# EAGLE design MyDaq Breadboard (EAGLE 6.4)
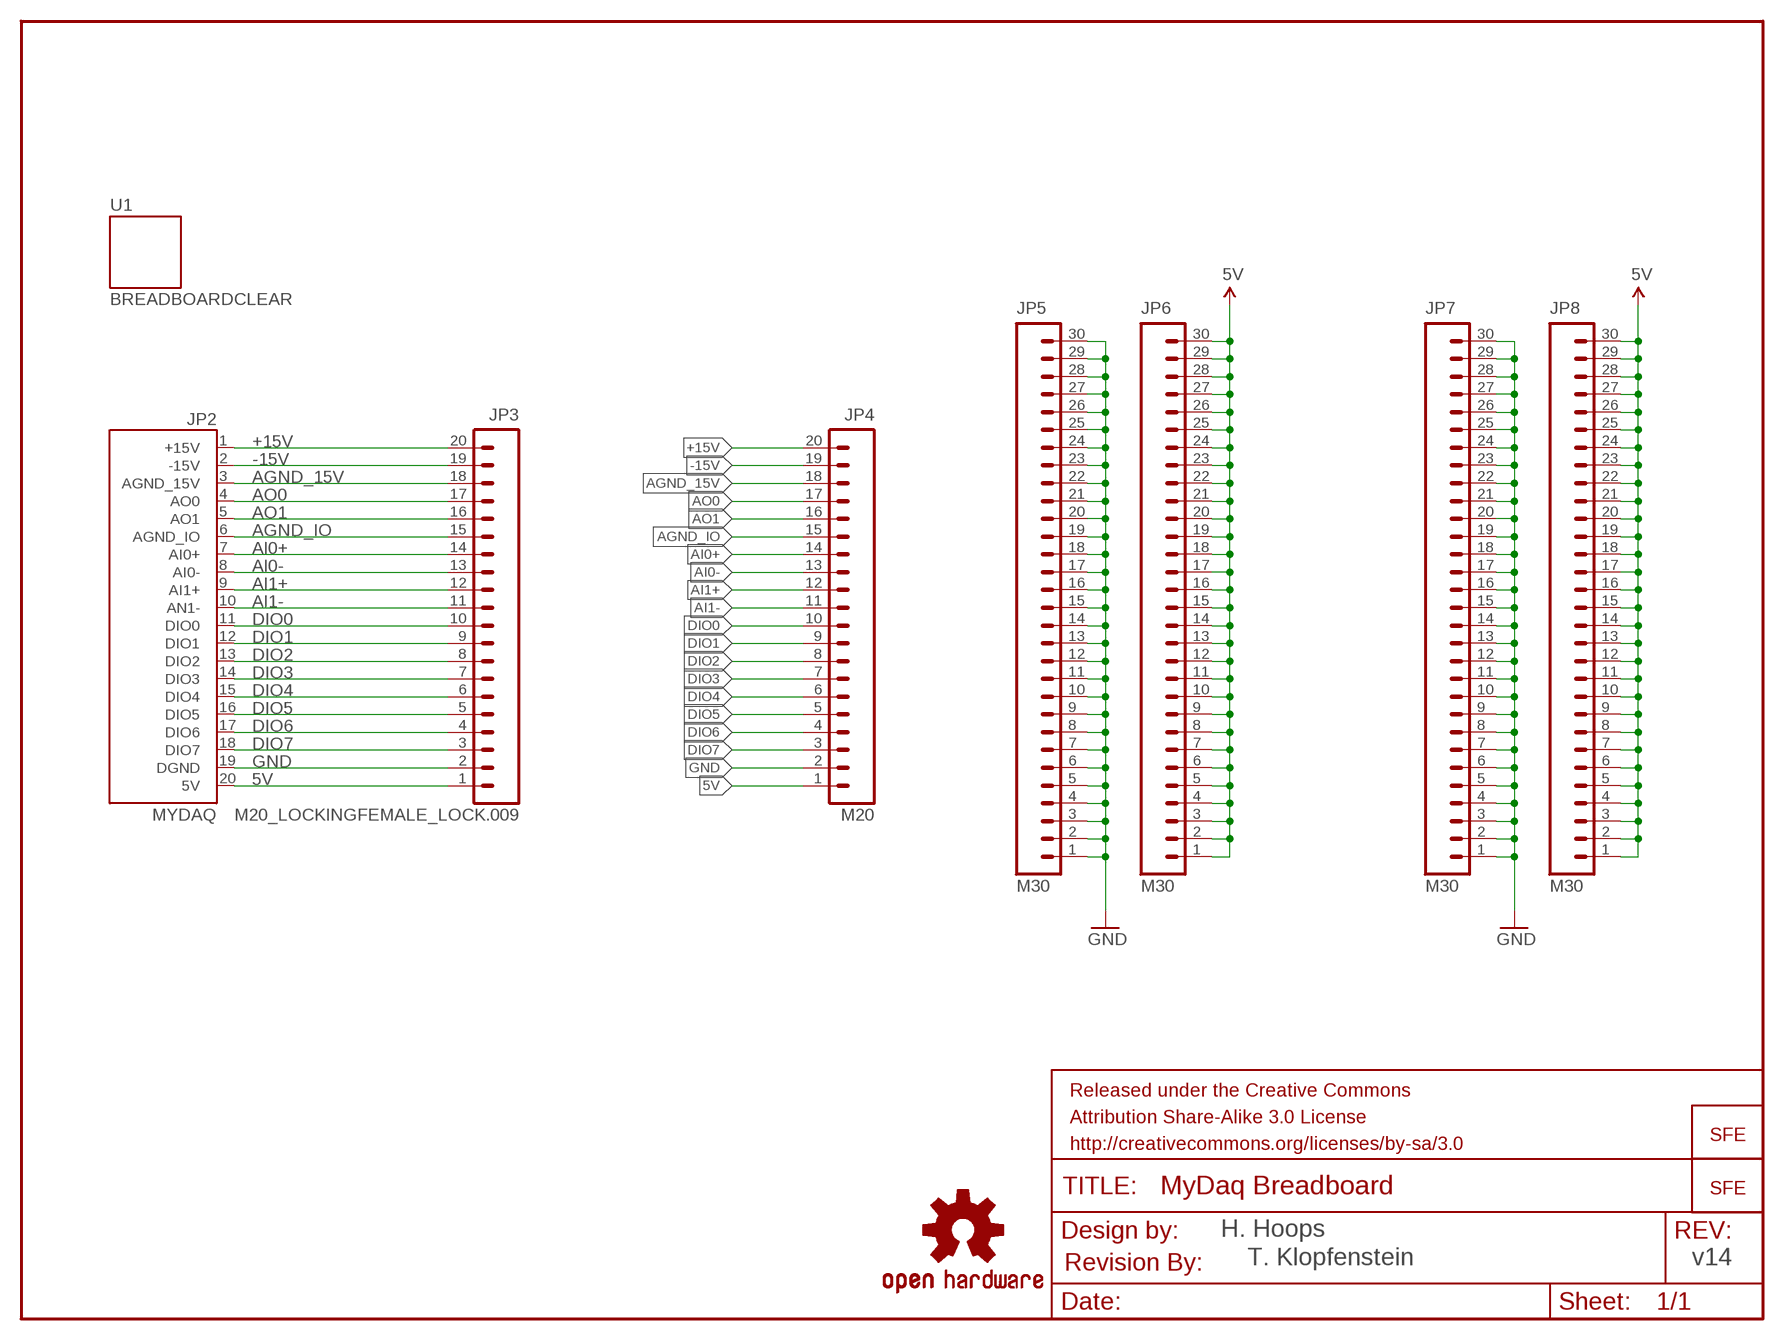
[diagram p0: schematic, sheet 1]

## Parts
FRAME2  FRAME-LETTER  [CREATIVE_COMMONS]
JP1  LOGO-SFENEW  [SFE-NEW-WEBLOGO]
JP2  MYDAQ  [3.81MM_TERMINAL_BLOCK_FEMALE_LOCKING]
JP3  M20_LOCKINGFEMALE_LOCK.009  M20_LOCKINGLOCK  [1X20_LOCK]
JP4  M20  [1X20]
JP5  M30  [1X30]
JP6  M30  [1X30]
JP7  M30  [1X30]
JP8  M30  [1X30]
LOGO1  OSHW-LOGOL  [OSHW-LOGO-L]
LOGO2  LOGO-SFESK  [SFE-LOGO-FLAME]
U1  BREADBOARDCLEAR  [BREADBOARD_CLEAR]
U$3  REVISION  [REVISION]

## Nets
5V: JP2.20(5V) JP3.1 JP4.1 JP6.1 JP6.2 JP6.3 JP6.4 JP6.5 JP6.6 JP6.7 JP6.8 JP6.9 JP6.10 JP6.11 JP6.12 JP6.13 JP6.14 JP6.15 JP6.16 JP6.17 JP6.18 JP6.19 JP6.20 JP6.21 JP6.22 JP6.23 JP6.24 JP6.25 JP6.26 JP6.27 JP6.28 JP6.29 JP6.30 JP8.1 JP8.2 JP8.3 JP8.4 JP8.5 JP8.6 JP8.7 JP8.8 JP8.9 JP8.10 JP8.11 JP8.12 JP8.13 JP8.14 JP8.15 JP8.16 JP8.17 JP8.18 JP8.19 JP8.20 JP8.21 JP8.22 JP8.23 JP8.24 JP8.25 JP8.26 JP8.27 JP8.28 JP8.29 JP8.30
+15V: JP2.1(+15V) JP3.20 JP4.20
-15V: JP2.2(-15V) JP3.19 JP4.19
AGND_15V: JP2.3(AGND_15V) JP3.18 JP4.18
AGND_IO: JP2.6(AGND_IO) JP3.15 JP4.15
AI0+: JP2.7(AI0+) JP3.14 JP4.14
AI0-: JP2.8(AI0-) JP3.13 JP4.13
AI1+: JP2.9(AI1+) JP3.12 JP4.12
AI1-: JP2.10(AN1-) JP3.11 JP4.11
AO0: JP2.4(AO0) JP3.17 JP4.17
AO1: JP2.5(AO1) JP3.16 JP4.16
DIO0: JP2.11(DIO0) JP3.10 JP4.10
DIO1: JP2.12(DIO1) JP3.9 JP4.9
DIO2: JP2.13(DIO2) JP3.8 JP4.8
DIO3: JP2.14(DIO3) JP3.7 JP4.7
DIO4: JP2.15(DIO4) JP3.6 JP4.6
DIO5: JP2.16(DIO5) JP3.5 JP4.5
DIO6: JP2.17(DIO6) JP3.4 JP4.4
DIO7: JP2.18(DIO7) JP3.3 JP4.3
GND: JP2.19(DGND) JP3.2 JP4.2 JP5.1 JP5.2 JP5.3 JP5.4 JP5.5 JP5.6 JP5.7 JP5.8 JP5.9 JP5.10 JP5.11 JP5.12 JP5.13 JP5.14 JP5.15 JP5.16 JP5.17 JP5.18 JP5.19 JP5.20 JP5.21 JP5.22 JP5.23 JP5.24 JP5.25 JP5.26 JP5.27 JP5.28 JP5.29 JP5.30 JP7.1 JP7.2 JP7.3 JP7.4 JP7.5 JP7.6 JP7.7 JP7.8 JP7.9 JP7.10 JP7.11 JP7.12 JP7.13 JP7.14 JP7.15 JP7.16 JP7.17 JP7.18 JP7.19 JP7.20 JP7.21 JP7.22 JP7.23 JP7.24 JP7.25 JP7.26 JP7.27 JP7.28 JP7.29 JP7.30

## Notes on the sheet
- H. Hoops
- T. Klopfenstein | v14

## Library data of the parts
FRAME2 = SparkFun-Aesthetics:FRAME-LETTER: Schematic Frame Standard 8.5x11 US Letter frame
JP1 = SparkFun:LOGO-SFE: Spark Fun Electronics PCB Logo This is the standard Spark Fun Electronics PCB logo.
JP2 = Local Lirary:MYDAQ
JP3 = Local Library:M20_LOCKING: This is just like the LOCK variant in that the holes are staggared by 5 mil, but except for the last two holes. They are not altered from the "standard" footprint layout. This is used for a special purpose on the layout of our Graphic LCD Backpack. Make sure you want to use this device before selecting it for you project!
JP4 = Local Lirary:M20: This is just like the LOCK variant in that the holes are staggared by 5 mil, but except for the last two holes. They are not altered from the "standard" footprint layout. This is used for a special purpose on the layout of our Graphic LCD Backpack. Make sure you want to use this device before selecting it for you project!
JP5-JP8 = Local Library:M30
LOGO1 = SparkFun-Aesthetics:OSHW-LOGO: Open Source Hardware Logo This logo indicates the piece of hardware it is found on incorporates a OSHW license and/or adheres to the definition of open source hardware found here: http://freedomdefined.org/OSHW
LOGO2 = SparkFun-Aesthetics:LOGO-SFE: Spark Fun Electronics PCB Logo This is the standard Spark Fun Electronics PCB logo.
U1 = Local Lirary:BREADBOARD: Breadboard Mini Self Adhesive This is the mechnical outline for the very small self adhesive breadboard from SparkFun Electronics. Good for very small proto areas. SKU : PRT-07916
U$3 = SparkFun-Aesthetics:REVISION

## Board
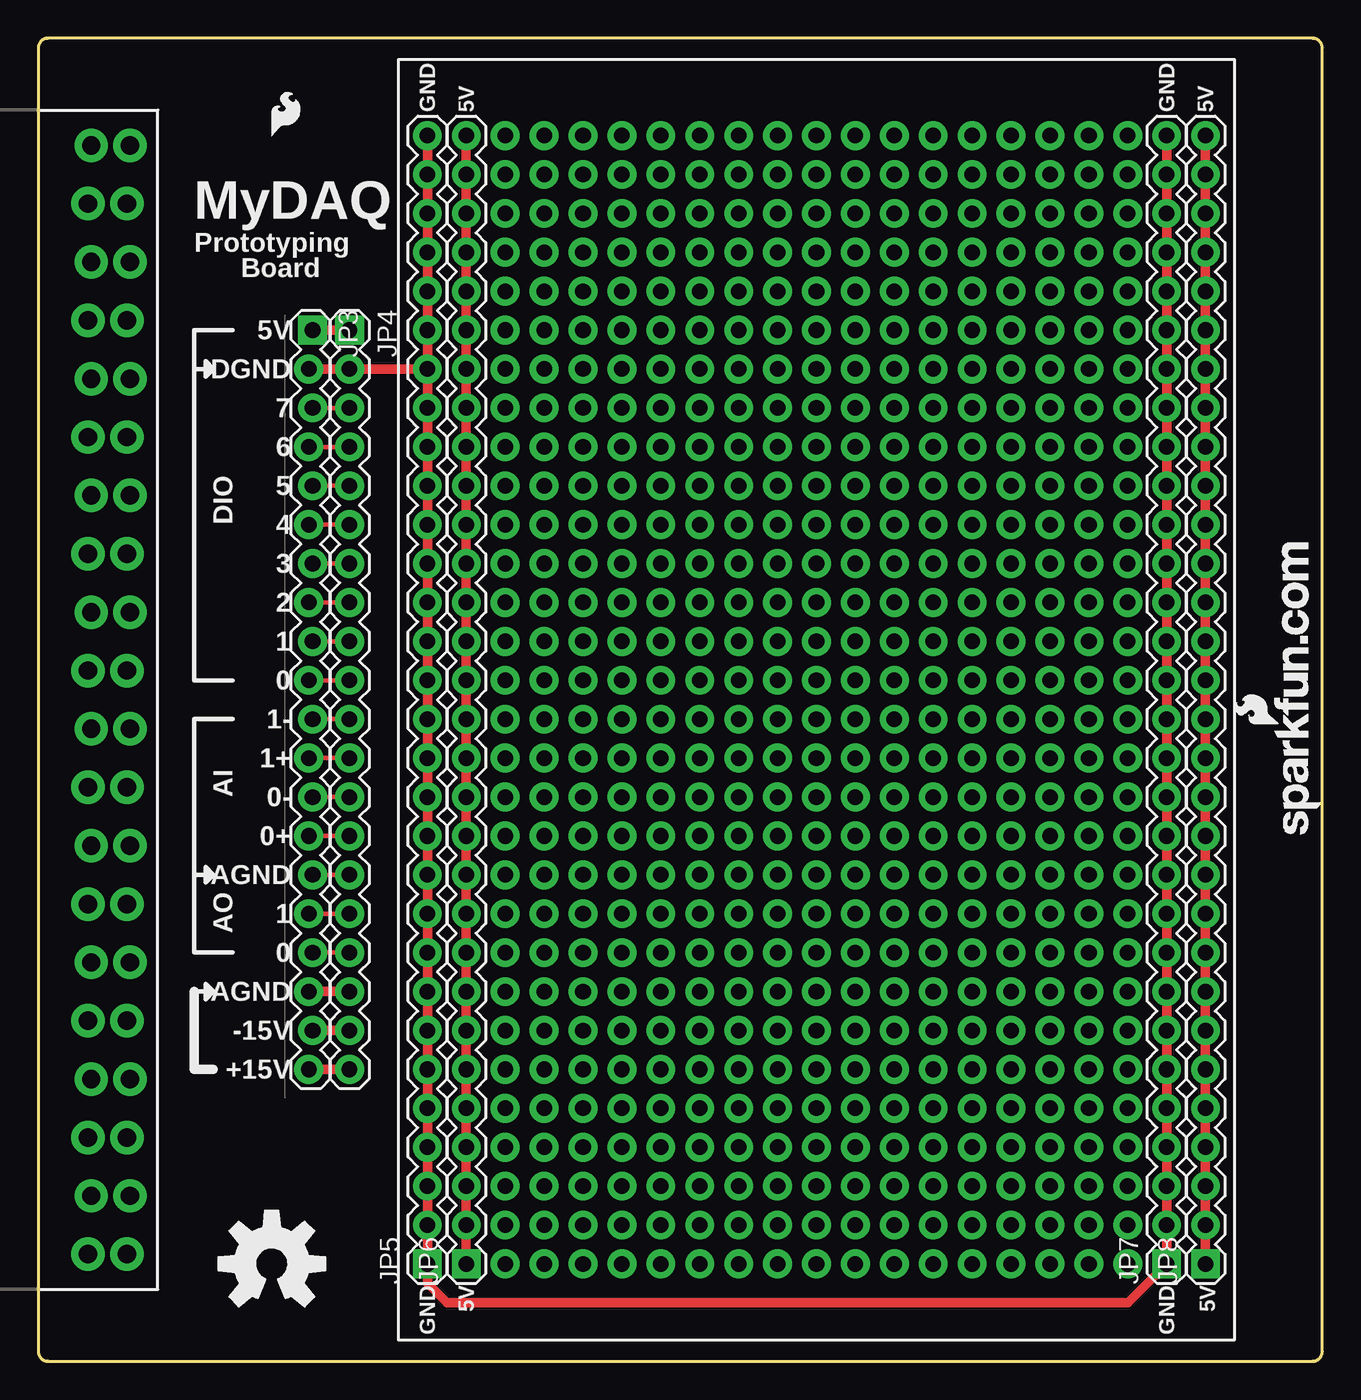
[diagram p1: board, top side]
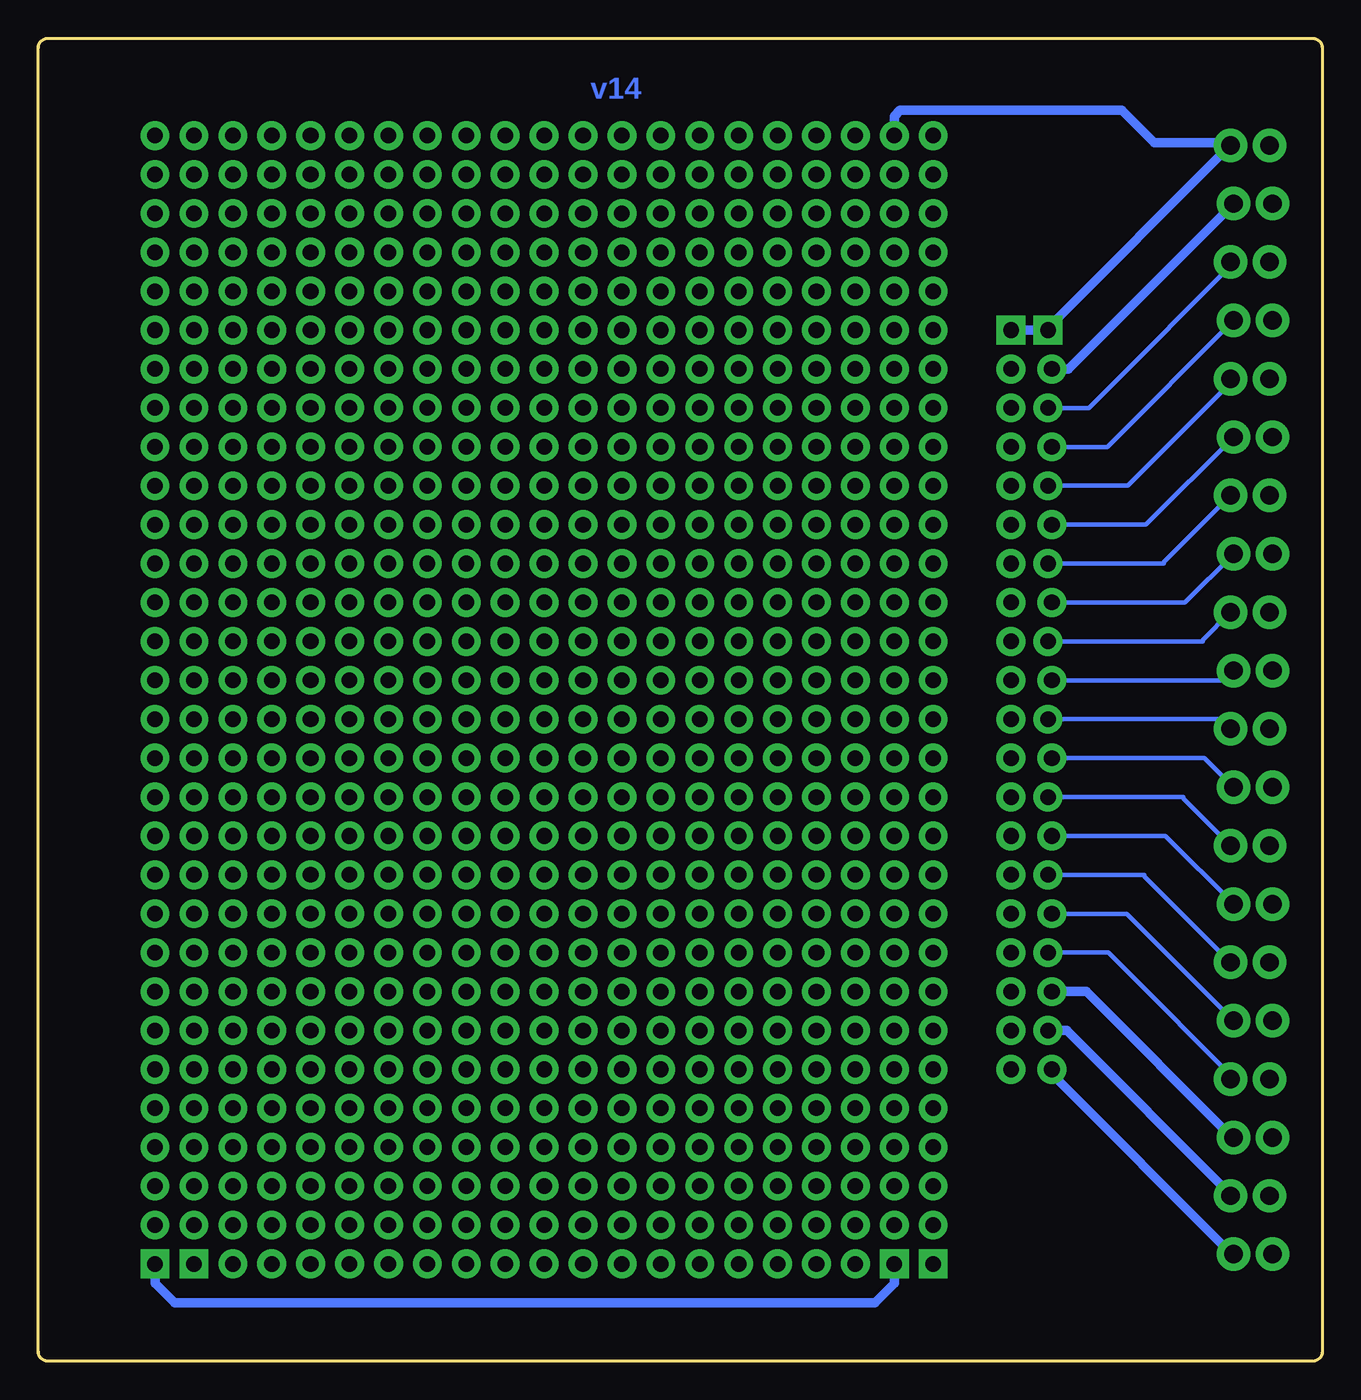
[diagram p2: board, bottom side, seen from below]

Size 83.82 x 86.36 mm. Coordinates in mm from the lower left corner, seen from the top.
Outline: 83.19,0 arc90 83.82,0.64 83.82,85.72 arc90 83.19,86.36 0.64,86.36 arc90 0,85.72 0,0.64 arc90 0.64,0 83.19,0
Copper layers (1*16): Top 0.035mm / dielectric 1.5mm / Bottom 0.035mm
Design rules "SparkFun": minimum track width 8mil, minimum drill 20mil, track to track 8mil, track to pad 8mil, pad to pad 8mil, via to via 8mil, smd to smd 8mil, copper to edge 8mil, drill to drill 8mil, minimum pad ring 12mil, minimum via ring 10mil, stop-mask expansion 4mil, vias tented up to drill 20mil, thermal gap 10mil

### Footprints (pad centres in the part's own frame; a part is rotated, then mirrored left to right if it is on the bottom)
3.81MM_TERMINAL_BLOCK_FEMALE_LOCKING = drill 1.2 pad 2.184: 1 4.521,-36.194; 2 4.724,-32.384; 3 4.521,-28.574; 4 4.724,-24.764; 5 4.521,-20.954; 6 4.724,-17.144; 7 4.521,-13.334; 8 4.724,-9.524; 9 4.521,-5.714; 10 4.724,-1.904; 11 4.521,1.906; 12 4.724,5.716; 13 4.521,9.526; 14 4.724,13.336; 15 4.521,17.146; 16 4.724,20.956; 17 4.521,24.766; 18 4.724,28.576; 19 4.521,32.386; 20 4.724,36.196; @1 1.981,-36.194; @2 2.184,-32.384; @3 1.981,-28.574; @4 2.184,-24.764; @5 1.981,-20.954; @6 2.184,-17.144; @7 1.981,-13.334; @8 2.184,-9.524; @9 1.981,-5.714; @10 2.184,-1.904; @11 1.981,1.906; @12 2.184,5.716; @13 1.981,9.526; @14 2.184,13.336; @15 1.981,17.146; @16 2.184,20.956; @17 1.981,24.766; @18 2.184,28.576; @19 1.981,32.386; @20 2.184,36.196
1X20_LOCK = drill 1.016 pad 1.88 square: 1 0,0.127 | drill 1.016 pad 1.88: 2 2.54,-0.127; 3 5.08,0.127; 4 7.62,-0.127; 5 10.16,0.127; 6 12.7,-0.127; 7 15.24,0.127; 8 17.78,-0.127; 9 20.32,0.127; 10 22.86,-0.127; 11 25.4,0.127; 12 27.94,-0.127; 13 30.48,0.127; 14 33.02,-0.127; 15 35.56,0.127; 16 38.1,-0.127; 17 40.64,0.127; 18 43.18,-0.127; 19 45.72,0.127; 20 48.26,-0.127
1X20 = drill 1.016 pad 1.88 square: 1 0,0 | drill 1.016 pad 1.88: 2 2.54,0; 3 5.08,0; 4 7.62,0; 5 10.16,0; 6 12.7,0; 7 15.24,0; 8 17.78,0; 9 20.32,0; 10 22.86,0; 11 25.4,0; 12 27.94,0; 13 30.48,0; 14 33.02,0; 15 35.56,0; 16 38.1,0; 17 40.64,0; 18 43.18,0; 19 45.72,0; 20 48.26,0
1X30 = drill 1.016 pad 1.88 square: 1 0,0 | drill 1.016 pad 1.88: 2 2.54,0; 3 5.08,0; 4 7.62,0; 5 10.16,0; 6 12.7,0; 7 15.24,0; 8 17.78,0; 9 20.32,0; 10 22.86,0; 11 25.4,0; 12 27.94,0; 13 30.48,0; 14 33.02,0; 15 35.56,0; 16 38.1,0; 17 40.64,0; 18 43.18,0; 19 45.72,0; 20 48.26,0; 21 50.8,0; 22 53.34,0; 23 55.88,0; 24 58.42,0; 25 60.96,0; 26 63.5,0; 27 66.04,0; 28 68.58,0; 29 71.12,0; 30 73.66,0

### Placement (x,y rotation side)
FRAME2  -7.09,-7.62 0 top  (outside the outline)
JP1  83.82,34.42 90 top
JP2  1.27,43.18 0 top
JP3  17.78,67.31 270 top
JP4  20.32,67.31 270 top
JP5  25.4,6.35 90 top
JP6  27.94,6.35 90 top
JP7  73.66,6.35 90 top
JP8  76.2,6.35 90 top
LOGO1  15.24,6.35 0 top
LOGO2  15.24,80.01 0 top
U1  50.8,43.18 90 top
U$3  4.45,-10.54 0 top  (outside the outline)

### Tracks (layer width: path | path; a pad name or v marks a point on that pad's centre or on a via)
5V
  Top 0.61: JP6.30 JP6.29 JP6.28 JP6.27 JP6.26 JP6.25 JP6.24 JP6.23 JP6.22 JP6.21 JP6.20 JP6.19 JP6.18 JP6.17 JP6.16 JP6.15 JP6.14 JP6.13 JP6.12 JP6.11 JP6.10 JP6.9 JP6.8 JP6.7 JP6.6 JP6.5 JP6.4 JP6.3 JP6.2 JP6.1 | JP8.1 JP8.2 JP8.3 JP8.4 JP8.5 JP8.6 JP8.7 JP8.8 JP8.9 JP8.10 JP8.11 JP8.12 JP8.13 JP8.14 JP8.15 JP8.16 JP8.17 JP8.18 JP8.19 JP8.20 JP8.21 JP8.22 JP8.23 JP8.24 JP8.25 JP8.26 JP8.27 JP8.28 JP8.29 JP8.30 | JP4.1 JP3.1
  Bottom 0.305: JP3.1 17.91,67.36
  Bottom 0.61: JP6.30 27.94,81.28 27.56,81.66 13.08,81.66 10.97,79.55 6.17,79.55 JP2.20 18.06,67.31 JP4.1 | JP8.30 76.07,80.01 | JP6.1 27.94,5.08 29.21,3.81 74.93,3.81 76.2,5.08 JP8.1
+15V
  Top 0.61: JP3.20 JP4.20
  Bottom 0.61: JP3.20 17.65,18.75 5.89,6.99 JP2.1
-15V
  Top 0.61: JP3.19 JP4.19
  Bottom 0.61: JP3.19 16.69,21.59 5.99,10.9 JP2.2
AGND_15V
  Top 0.61: JP3.18 JP4.18
  Bottom 0.61: JP3.18 15.42,24.13 5.89,14.61 JP2.3
AGND_IO
  Top 0.305: JP3.15 JP4.15
  Bottom 0.305: JP3.15 11.61,31.75 11.61,31.65 JP2.6
AI0+
  Top 0.305: JP3.14 JP4.14
  Bottom 0.305: JP3.14 10.34,34.29 10.23,34.29 JP2.7
AI0-
  Top 0.305: JP3.13 JP4.13
  Bottom 0.305: JP3.13 9.07,36.83 9.07,36.73 JP2.8
AI1+
  Top 0.305: JP3.12 JP4.12
  Bottom 0.305: JP3.12 7.8,39.37 7.7,39.37 JP2.9
AI1-
  Top 0.305: JP3.11 JP4.11
  Bottom 0.305: JP3.11 6.53,41.91 6.53,41.81 JP2.10
AO0
  Top 0.305: JP3.17 JP4.17
  Bottom 0.305: JP3.17 14.15,26.67 13.97,26.67 12.7,25.4 5.99,18.69 JP2.4
AO1
  Top 0.305: JP3.16 JP4.16
  Bottom 0.305: JP3.16 12.88,29.21 12.78,29.21 JP2.5
DIO0
  Top 0.305: JP3.10 JP4.10
  Bottom 0.305: JP3.10 6.53,44.45 6.43,44.45 JP2.11
DIO1
  Top 0.305: JP3.9 JP4.9
  Bottom 0.305: JP3.9 7.8,46.99 7.8,47.09 JP2.12
DIO2
  Top 0.305: JP3.8 JP4.8
  Bottom 0.305: JP3.8 9.07,49.53 8.97,49.53 JP2.13
DIO3
  Top 0.305: JP3.7 JP4.7
  Bottom 0.305: JP3.7 10.34,52.07 10.34,52.17 JP2.14
DIO4
  Top 0.305: JP3.6 JP4.6
  Bottom 0.305: JP3.6 11.61,54.61 11.51,54.61 JP2.15
DIO5
  Top 0.305: JP3.5 JP4.5
  Bottom 0.305: JP3.5 12.88,57.15 12.7,57.15 11.43,58.42 5.99,63.86 JP2.16
DIO6
  Top 0.305: JP3.4 JP4.4
  Bottom 0.305: JP3.4 14.15,59.69 14.05,59.69 JP2.17
DIO7
  Top 0.305: JP3.3 JP4.3
  Bottom 0.305: JP3.3 15.42,62.23 15.24,62.23 13.97,63.5 5.99,71.48 JP2.18
GND
  Top 0.61: JP7.30 JP7.29 JP7.28 JP7.27 JP7.26 JP7.25 JP7.24 JP7.23 JP7.22 JP7.21 JP7.20 JP7.19 JP7.18 JP7.17 JP7.16 JP7.15 JP7.14 JP7.13 JP7.12 JP7.11 JP7.10 JP7.9 JP7.8 JP7.7 JP7.6 JP7.5 JP7.4 JP7.3 JP7.2 JP7.1 71.12,3.81 26.67,3.81 25.4,5.08 JP5.1 JP5.2 JP5.3 JP5.4 JP5.5 JP5.6 JP5.7 JP5.8 JP5.9 JP5.10 JP5.11 JP5.12 JP5.13 JP5.14 JP5.15 JP5.16 JP5.17 JP5.18 JP5.19 JP5.20 JP5.21 JP5.22 JP5.23 JP5.24 | JP5.24 JP5.25 JP5.26 JP5.27 JP5.28 JP5.29 JP5.30 | JP3.2 JP4.2 JP5.24
  Bottom 0.61: JP3.2 16.69,64.77 16.59,64.77 JP2.19
N$1  (via drill 1.02 pad 1.88)
  other vias: 66.04,77.47
N$2  (via drill 1.02 pad 1.88)
  other vias: 63.5,77.47
N$3  (via drill 1.02 pad 1.88)
  other vias: 60.96,77.47
N$4  (via drill 1.02 pad 1.88)
  other vias: 30.48,80.01
N$5  (via drill 1.02 pad 1.88)
  other vias: 33.02,80.01
N$6  (via drill 1.02 pad 1.88)
  other vias: 35.56,80.01
N$7  (via drill 1.02 pad 1.88)
  other vias: 38.1,80.01
N$8  (via drill 1.02 pad 1.88)
  other vias: 40.64,80.01
N$9  (via drill 1.02 pad 1.88)
  other vias: 43.18,80.01
N$10  (via drill 1.02 pad 1.88)
  other vias: 45.72,80.01
N$11  (via drill 1.02 pad 1.88)
  other vias: 48.26,80.01
N$12  (via drill 1.02 pad 1.88)
  other vias: 50.8,80.01
N$13  (via drill 1.02 pad 1.88)
  other vias: 53.34,80.01
N$14  (via drill 1.02 pad 1.88)
  other vias: 55.88,80.01
N$15  (via drill 1.02 pad 1.88)
  other vias: 58.42,80.01
N$16  (via drill 1.02 pad 1.88)
  other vias: 66.04,80.01
N$17  (via drill 1.02 pad 1.88)
  other vias: 63.5,80.01
N$18  (via drill 1.02 pad 1.88)
  other vias: 60.96,80.01
N$19  (via drill 1.02 pad 1.88)
  other vias: 30.48,77.47
N$20  (via drill 1.02 pad 1.88)
  other vias: 33.02,77.47
N$21  (via drill 1.02 pad 1.88)
  other vias: 35.56,77.47
N$22  (via drill 1.02 pad 1.88)
  other vias: 38.1,77.47
N$23  (via drill 1.02 pad 1.88)
  other vias: 40.64,77.47
N$24  (via drill 1.02 pad 1.88)
  other vias: 43.18,77.47
N$25  (via drill 1.02 pad 1.88)
  other vias: 45.72,77.47
N$26  (via drill 1.02 pad 1.88)
  other vias: 48.26,77.47
N$27  (via drill 1.02 pad 1.88)
  other vias: 50.8,77.47
N$28  (via drill 1.02 pad 1.88)
  other vias: 53.34,77.47
N$29  (via drill 1.02 pad 1.88)
  other vias: 55.88,77.47
N$30  (via drill 1.02 pad 1.88)
  other vias: 58.42,77.47
N$31  (via drill 1.02 pad 1.88)
  other vias: 68.58,80.01
N$32  (via drill 1.02 pad 1.88)
  other vias: 71.12,80.01
N$33  (via drill 1.02 pad 1.88)
  other vias: 68.58,77.47
N$34  (via drill 1.02 pad 1.88)
  other vias: 71.12,77.47
N$35  (via drill 1.02 pad 1.88)
  other vias: 30.48,74.93
N$36  (via drill 1.02 pad 1.88)
  other vias: 33.02,74.93
N$37  (via drill 1.02 pad 1.88)
  other vias: 35.56,74.93
N$38  (via drill 1.02 pad 1.88)
  other vias: 38.1,74.93
N$39  (via drill 1.02 pad 1.88)
  other vias: 40.64,74.93
N$40  (via drill 1.02 pad 1.88)
  other vias: 43.18,74.93
N$41  (via drill 1.02 pad 1.88)
  other vias: 45.72,74.93
N$42  (via drill 1.02 pad 1.88)
  other vias: 48.26,74.93
N$43  (via drill 1.02 pad 1.88)
  other vias: 50.8,74.93
N$44  (via drill 1.02 pad 1.88)
  other vias: 53.34,74.93
N$45  (via drill 1.02 pad 1.88)
  other vias: 55.88,74.93
N$46  (via drill 1.02 pad 1.88)
  other vias: 58.42,74.93
N$47  (via drill 1.02 pad 1.88)
  other vias: 66.04,69.85
N$48  (via drill 1.02 pad 1.88)
  other vias: 63.5,69.85
N$49  (via drill 1.02 pad 1.88)
  other vias: 60.96,69.85
N$50  (via drill 1.02 pad 1.88)
  other vias: 30.48,72.39
N$51  (via drill 1.02 pad 1.88)
  other vias: 33.02,72.39
N$52  (via drill 1.02 pad 1.88)
  other vias: 35.56,72.39
N$53  (via drill 1.02 pad 1.88)
  other vias: 38.1,72.39
N$54  (via drill 1.02 pad 1.88)
  other vias: 40.64,72.39
N$55  (via drill 1.02 pad 1.88)
  other vias: 43.18,72.39
N$56  (via drill 1.02 pad 1.88)
  other vias: 45.72,72.39
N$57  (via drill 1.02 pad 1.88)
  other vias: 48.26,72.39
N$58  (via drill 1.02 pad 1.88)
  other vias: 50.8,72.39
N$59  (via drill 1.02 pad 1.88)
  other vias: 53.34,72.39
N$60  (via drill 1.02 pad 1.88)
  other vias: 55.88,72.39
N$61  (via drill 1.02 pad 1.88)
  other vias: 58.42,72.39
N$62  (via drill 1.02 pad 1.88)
  other vias: 66.04,72.39
N$63  (via drill 1.02 pad 1.88)
  other vias: 63.5,72.39
N$64  (via drill 1.02 pad 1.88)
  other vias: 60.96,72.39
N$65  (via drill 1.02 pad 1.88)
  other vias: 30.48,69.85
N$66  (via drill 1.02 pad 1.88)
  other vias: 33.02,69.85
N$67  (via drill 1.02 pad 1.88)
  other vias: 35.56,69.85
N$68  (via drill 1.02 pad 1.88)
  other vias: 38.1,69.85
N$69  (via drill 1.02 pad 1.88)
  other vias: 40.64,69.85
N$70  (via drill 1.02 pad 1.88)
  other vias: 43.18,69.85
N$71  (via drill 1.02 pad 1.88)
  other vias: 45.72,69.85
N$72  (via drill 1.02 pad 1.88)
  other vias: 48.26,69.85
N$73  (via drill 1.02 pad 1.88)
  other vias: 50.8,69.85
N$74  (via drill 1.02 pad 1.88)
  other vias: 53.34,69.85
N$75  (via drill 1.02 pad 1.88)
  other vias: 55.88,69.85
N$76  (via drill 1.02 pad 1.88)
  other vias: 58.42,69.85
N$77  (via drill 1.02 pad 1.88)
  other vias: 66.04,74.93
N$78  (via drill 1.02 pad 1.88)
  other vias: 63.5,74.93
N$79  (via drill 1.02 pad 1.88)
  other vias: 60.96,74.93
N$80  (via drill 1.02 pad 1.88)
  other vias: 68.58,74.93
N$81  (via drill 1.02 pad 1.88)
  other vias: 71.12,74.93
N$82  (via drill 1.02 pad 1.88)
  other vias: 68.58,72.39
N$83  (via drill 1.02 pad 1.88)
  other vias: 71.12,72.39
N$84  (via drill 1.02 pad 1.88)
  other vias: 68.58,69.85
N$85  (via drill 1.02 pad 1.88)
  other vias: 71.12,69.85
N$86  (via drill 1.02 pad 1.88)
  other vias: 30.48,67.31
N$87  (via drill 1.02 pad 1.88)
  other vias: 33.02,67.31
N$88  (via drill 1.02 pad 1.88)
  other vias: 35.56,67.31
N$89  (via drill 1.02 pad 1.88)
  other vias: 38.1,67.31
N$90  (via drill 1.02 pad 1.88)
  other vias: 40.64,67.31
N$91  (via drill 1.02 pad 1.88)
  other vias: 43.18,67.31
N$92  (via drill 1.02 pad 1.88)
  other vias: 45.72,67.31
N$93  (via drill 1.02 pad 1.88)
  other vias: 48.26,67.31
N$94  (via drill 1.02 pad 1.88)
  other vias: 50.8,67.31
N$95  (via drill 1.02 pad 1.88)
  other vias: 53.34,67.31
N$96  (via drill 1.02 pad 1.88)
  other vias: 55.88,67.31
N$97  (via drill 1.02 pad 1.88)
  other vias: 58.42,67.31
N$98  (via drill 1.02 pad 1.88)
  other vias: 66.04,62.23
N$99  (via drill 1.02 pad 1.88)
  other vias: 63.5,62.23
N$100  (via drill 1.02 pad 1.88)
  other vias: 60.96,62.23
N$101  (via drill 1.02 pad 1.88)
  other vias: 30.48,64.77
N$102  (via drill 1.02 pad 1.88)
  other vias: 33.02,64.77
N$103  (via drill 1.02 pad 1.88)
  other vias: 35.56,64.77
N$104  (via drill 1.02 pad 1.88)
  other vias: 38.1,64.77
N$105  (via drill 1.02 pad 1.88)
  other vias: 40.64,64.77
N$106  (via drill 1.02 pad 1.88)
  other vias: 43.18,64.77
N$107  (via drill 1.02 pad 1.88)
  other vias: 45.72,64.77
N$108  (via drill 1.02 pad 1.88)
  other vias: 48.26,64.77
N$109  (via drill 1.02 pad 1.88)
  other vias: 50.8,64.77
N$110  (via drill 1.02 pad 1.88)
  other vias: 53.34,64.77
N$111  (via drill 1.02 pad 1.88)
  other vias: 55.88,64.77
N$112  (via drill 1.02 pad 1.88)
  other vias: 58.42,64.77
N$113  (via drill 1.02 pad 1.88)
  other vias: 66.04,64.77
N$114  (via drill 1.02 pad 1.88)
  other vias: 63.5,64.77
N$115  (via drill 1.02 pad 1.88)
  other vias: 60.96,64.77
N$116  (via drill 1.02 pad 1.88)
  other vias: 30.48,62.23
N$117  (via drill 1.02 pad 1.88)
  other vias: 33.02,62.23
N$118  (via drill 1.02 pad 1.88)
  other vias: 35.56,62.23
N$119  (via drill 1.02 pad 1.88)
  other vias: 38.1,62.23
N$120  (via drill 1.02 pad 1.88)
  other vias: 40.64,62.23
N$121  (via drill 1.02 pad 1.88)
  other vias: 43.18,62.23
N$122  (via drill 1.02 pad 1.88)
  other vias: 45.72,62.23
N$123  (via drill 1.02 pad 1.88)
  other vias: 48.26,62.23
N$124  (via drill 1.02 pad 1.88)
  other vias: 50.8,62.23
N$125  (via drill 1.02 pad 1.88)
  other vias: 53.34,62.23
N$126  (via drill 1.02 pad 1.88)
  other vias: 55.88,62.23
N$127  (via drill 1.02 pad 1.88)
  other vias: 58.42,62.23
N$128  (via drill 1.02 pad 1.88)
  other vias: 66.04,67.31
N$129  (via drill 1.02 pad 1.88)
  other vias: 63.5,67.31
N$130  (via drill 1.02 pad 1.88)
  other vias: 60.96,67.31
N$131  (via drill 1.02 pad 1.88)
  other vias: 68.58,67.31
N$132  (via drill 1.02 pad 1.88)
  other vias: 71.12,67.31
N$133  (via drill 1.02 pad 1.88)
  other vias: 68.58,64.77
N$134  (via drill 1.02 pad 1.88)
  other vias: 71.12,64.77
N$135  (via drill 1.02 pad 1.88)
  other vias: 68.58,62.23
N$136  (via drill 1.02 pad 1.88)
  other vias: 71.12,62.23
N$137  (via drill 1.02 pad 1.88)
  other vias: 30.48,59.69
N$138  (via drill 1.02 pad 1.88)
  other vias: 33.02,59.69
N$139  (via drill 1.02 pad 1.88)
  other vias: 35.56,59.69
N$140  (via drill 1.02 pad 1.88)
  other vias: 38.1,59.69
N$141  (via drill 1.02 pad 1.88)
  other vias: 40.64,59.69
N$142  (via drill 1.02 pad 1.88)
  other vias: 43.18,59.69
N$143  (via drill 1.02 pad 1.88)
  other vias: 45.72,59.69
N$144  (via drill 1.02 pad 1.88)
  other vias: 48.26,59.69
N$145  (via drill 1.02 pad 1.88)
  other vias: 50.8,59.69
N$146  (via drill 1.02 pad 1.88)
  other vias: 53.34,59.69
N$147  (via drill 1.02 pad 1.88)
  other vias: 55.88,59.69
N$148  (via drill 1.02 pad 1.88)
  other vias: 58.42,59.69
N$149  (via drill 1.02 pad 1.88)
  other vias: 66.04,59.69
N$150  (via drill 1.02 pad 1.88)
  other vias: 63.5,59.69
N$151  (via drill 1.02 pad 1.88)
  other vias: 60.96,59.69
N$152  (via drill 1.02 pad 1.88)
  other vias: 68.58,59.69
N$153  (via drill 1.02 pad 1.88)
  other vias: 71.12,59.69
N$215  (via drill 1.02 pad 1.88)
  other vias: 66.04,54.61
N$216  (via drill 1.02 pad 1.88)
  other vias: 63.5,54.61
N$217  (via drill 1.02 pad 1.88)
  other vias: 60.96,54.61
N$220  (via drill 1.02 pad 1.88)
  other vias: 30.48,57.15
N$221  (via drill 1.02 pad 1.88)
  other vias: 33.02,57.15
N$222  (via drill 1.02 pad 1.88)
  other vias: 35.56,57.15
N$223  (via drill 1.02 pad 1.88)
  other vias: 38.1,57.15
N$224  (via drill 1.02 pad 1.88)
  other vias: 40.64,57.15
N$225  (via drill 1.02 pad 1.88)
  other vias: 43.18,57.15
N$226  (via drill 1.02 pad 1.88)
  other vias: 45.72,57.15
N$227  (via drill 1.02 pad 1.88)
  other vias: 48.26,57.15
N$228  (via drill 1.02 pad 1.88)
  other vias: 50.8,57.15
N$229  (via drill 1.02 pad 1.88)
  other vias: 53.34,57.15
N$230  (via drill 1.02 pad 1.88)
  other vias: 55.88,57.15
N$231  (via drill 1.02 pad 1.88)
  other vias: 58.42,57.15
N$232  (via drill 1.02 pad 1.88)
  other vias: 66.04,57.15
N$233  (via drill 1.02 pad 1.88)
  other vias: 63.5,57.15
N$234  (via drill 1.02 pad 1.88)
  other vias: 60.96,57.15
N$237  (via drill 1.02 pad 1.88)
  other vias: 30.48,54.61
N$238  (via drill 1.02 pad 1.88)
  other vias: 33.02,54.61
N$239  (via drill 1.02 pad 1.88)
  other vias: 35.56,54.61
N$240  (via drill 1.02 pad 1.88)
  other vias: 38.1,54.61
N$241  (via drill 1.02 pad 1.88)
  other vias: 40.64,54.61
N$242  (via drill 1.02 pad 1.88)
  other vias: 43.18,54.61
N$243  (via drill 1.02 pad 1.88)
  other vias: 45.72,54.61
N$244  (via drill 1.02 pad 1.88)
  other vias: 48.26,54.61
N$245  (via drill 1.02 pad 1.88)
  other vias: 50.8,54.61
N$246  (via drill 1.02 pad 1.88)
  other vias: 53.34,54.61
N$247  (via drill 1.02 pad 1.88)
  other vias: 55.88,54.61
N$248  (via drill 1.02 pad 1.88)
  other vias: 58.42,54.61
N$255  (via drill 1.02 pad 1.88)
  other vias: 68.58,57.15
N$256  (via drill 1.02 pad 1.88)
  other vias: 71.12,57.15
N$258  (via drill 1.02 pad 1.88)
  other vias: 68.58,54.61
N$259  (via drill 1.02 pad 1.88)
  other vias: 71.12,54.61
N$263  (via drill 1.02 pad 1.88)
  other vias: 30.48,52.07
N$264  (via drill 1.02 pad 1.88)
  other vias: 33.02,52.07
N$265  (via drill 1.02 pad 1.88)
  other vias: 35.56,52.07
N$266  (via drill 1.02 pad 1.88)
  other vias: 38.1,52.07
N$267  (via drill 1.02 pad 1.88)
  other vias: 40.64,52.07
N$268  (via drill 1.02 pad 1.88)
  other vias: 43.18,52.07
N$269  (via drill 1.02 pad 1.88)
  other vias: 45.72,52.07
N$270  (via drill 1.02 pad 1.88)
  other vias: 48.26,52.07
N$271  (via drill 1.02 pad 1.88)
  other vias: 50.8,52.07
N$272  (via drill 1.02 pad 1.88)
  other vias: 53.34,52.07
N$273  (via drill 1.02 pad 1.88)
  other vias: 55.88,52.07
N$274  (via drill 1.02 pad 1.88)
  other vias: 58.42,52.07
N$275  (via drill 1.02 pad 1.88)
  other vias: 66.04,46.99
N$276  (via drill 1.02 pad 1.88)
  other vias: 63.5,46.99
N$277  (via drill 1.02 pad 1.88)
  other vias: 60.96,46.99
N$280  (via drill 1.02 pad 1.88)
  other vias: 30.48,49.53
N$281  (via drill 1.02 pad 1.88)
  other vias: 33.02,49.53
N$282  (via drill 1.02 pad 1.88)
  other vias: 35.56,49.53
N$283  (via drill 1.02 pad 1.88)
  other vias: 38.1,49.53
N$284  (via drill 1.02 pad 1.88)
  other vias: 40.64,49.53
N$285  (via drill 1.02 pad 1.88)
  other vias: 43.18,49.53
N$286  (via drill 1.02 pad 1.88)
  other vias: 45.72,49.53
N$287  (via drill 1.02 pad 1.88)
  other vias: 48.26,49.53
N$288  (via drill 1.02 pad 1.88)
  other vias: 50.8,49.53
N$289  (via drill 1.02 pad 1.88)
  other vias: 53.34,49.53
N$290  (via drill 1.02 pad 1.88)
  other vias: 55.88,49.53
N$291  (via drill 1.02 pad 1.88)
  other vias: 58.42,49.53
N$292  (via drill 1.02 pad 1.88)
  other vias: 66.04,49.53
N$293  (via drill 1.02 pad 1.88)
  other vias: 63.5,49.53
N$294  (via drill 1.02 pad 1.88)
  other vias: 60.96,49.53
N$297  (via drill 1.02 pad 1.88)
  other vias: 30.48,46.99
N$298  (via drill 1.02 pad 1.88)
  other vias: 33.02,46.99
N$299  (via drill 1.02 pad 1.88)
  other vias: 35.56,46.99
N$300  (via drill 1.02 pad 1.88)
  other vias: 38.1,46.99
N$301  (via drill 1.02 pad 1.88)
  other vias: 40.64,46.99
N$302  (via drill 1.02 pad 1.88)
  other vias: 43.18,46.99
N$303  (via drill 1.02 pad 1.88)
  other vias: 45.72,46.99
N$304  (via drill 1.02 pad 1.88)
  other vias: 48.26,46.99
N$305  (via drill 1.02 pad 1.88)
  other vias: 50.8,46.99
N$306  (via drill 1.02 pad 1.88)
  other vias: 53.34,46.99
N$307  (via drill 1.02 pad 1.88)
  other vias: 55.88,46.99
N$308  (via drill 1.02 pad 1.88)
  other vias: 58.42,46.99
N$309  (via drill 1.02 pad 1.88)
  other vias: 66.04,52.07
N$310  (via drill 1.02 pad 1.88)
  other vias: 63.5,52.07
N$311  (via drill 1.02 pad 1.88)
  other vias: 60.96,52.07
N$312  (via drill 1.02 pad 1.88)
  other vias: 68.58,52.07
N$313  (via drill 1.02 pad 1.88)
  other vias: 71.12,52.07
N$315  (via drill 1.02 pad 1.88)
  other vias: 68.58,49.53
N$316  (via drill 1.02 pad 1.88)
  other vias: 71.12,49.53
N$318  (via drill 1.02 pad 1.88)
  other vias: 68.58,46.99
N$319  (via drill 1.02 pad 1.88)
  other vias: 71.12,46.99
N$323  (via drill 1.02 pad 1.88)
  other vias: 30.48,44.45
N$324  (via drill 1.02 pad 1.88)
  other vias: 33.02,44.45
N$325  (via drill 1.02 pad 1.88)
  other vias: 35.56,44.45
N$326  (via drill 1.02 pad 1.88)
  other vias: 38.1,44.45
N$327  (via drill 1.02 pad 1.88)
  other vias: 40.64,44.45
N$328  (via drill 1.02 pad 1.88)
  other vias: 43.18,44.45
N$329  (via drill 1.02 pad 1.88)
  other vias: 45.72,44.45
N$330  (via drill 1.02 pad 1.88)
  other vias: 48.26,44.45
N$331  (via drill 1.02 pad 1.88)
  other vias: 50.8,44.45
N$332  (via drill 1.02 pad 1.88)
  other vias: 53.34,44.45
N$333  (via drill 1.02 pad 1.88)
  other vias: 55.88,44.45
N$334  (via drill 1.02 pad 1.88)
  other vias: 58.42,44.45
N$335  (via drill 1.02 pad 1.88)
  other vias: 66.04,39.37
N$336  (via drill 1.02 pad 1.88)
  other vias: 63.5,39.37
N$337  (via drill 1.02 pad 1.88)
  other vias: 60.96,39.37
N$340  (via drill 1.02 pad 1.88)
  other vias: 30.48,41.91
N$341  (via drill 1.02 pad 1.88)
  other vias: 33.02,41.91
N$342  (via drill 1.02 pad 1.88)
  other vias: 35.56,41.91
N$343  (via drill 1.02 pad 1.88)
  other vias: 38.1,41.91
N$344  (via drill 1.02 pad 1.88)
  other vias: 40.64,41.91
N$345  (via drill 1.02 pad 1.88)
  other vias: 43.18,41.91
N$346  (via drill 1.02 pad 1.88)
  other vias: 45.72,41.91
N$347  (via drill 1.02 pad 1.88)
  other vias: 48.26,41.91
N$348  (via drill 1.02 pad 1.88)
  other vias: 50.8,41.91
N$349  (via drill 1.02 pad 1.88)
  other vias: 53.34,41.91
N$350  (via drill 1.02 pad 1.88)
  other vias: 55.88,41.91
N$351  (via drill 1.02 pad 1.88)
  other vias: 58.42,41.91
N$352  (via drill 1.02 pad 1.88)
  other vias: 66.04,41.91
N$353  (via drill 1.02 pad 1.88)
  other vias: 63.5,41.91
N$354  (via drill 1.02 pad 1.88)
  other vias: 60.96,41.91
N$357  (via drill 1.02 pad 1.88)
  other vias: 30.48,39.37
N$358  (via drill 1.02 pad 1.88)
  other vias: 33.02,39.37
N$359  (via drill 1.02 pad 1.88)
  other vias: 35.56,39.37
N$360  (via drill 1.02 pad 1.88)
  other vias: 38.1,39.37
N$361  (via drill 1.02 pad 1.88)
  other vias: 40.64,39.37
N$362  (via drill 1.02 pad 1.88)
  other vias: 43.18,39.37
N$363  (via drill 1.02 pad 1.88)
  other vias: 45.72,39.37
N$364  (via drill 1.02 pad 1.88)
  other vias: 48.26,39.37
N$365  (via drill 1.02 pad 1.88)
  other vias: 50.8,39.37
N$366  (via drill 1.02 pad 1.88)
  other vias: 53.34,39.37
N$367  (via drill 1.02 pad 1.88)
  other vias: 55.88,39.37
N$368  (via drill 1.02 pad 1.88)
  other vias: 58.42,39.37
N$369  (via drill 1.02 pad 1.88)
  other vias: 66.04,44.45
N$370  (via drill 1.02 pad 1.88)
  other vias: 63.5,44.45
N$371  (via drill 1.02 pad 1.88)
  other vias: 60.96,44.45
N$372  (via drill 1.02 pad 1.88)
  other vias: 68.58,44.45
N$373  (via drill 1.02 pad 1.88)
  other vias: 71.12,44.45
N$375  (via drill 1.02 pad 1.88)
  other vias: 68.58,41.91
N$376  (via drill 1.02 pad 1.88)
  other vias: 71.12,41.91
N$378  (via drill 1.02 pad 1.88)
  other vias: 68.58,39.37
N$379  (via drill 1.02 pad 1.88)
  other vias: 71.12,39.37
N$383  (via drill 1.02 pad 1.88)
  other vias: 30.48,36.83
N$384  (via drill 1.02 pad 1.88)
  other vias: 33.02,36.83
N$385  (via drill 1.02 pad 1.88)
  other vias: 35.56,36.83
N$386  (via drill 1.02 pad 1.88)
  other vias: 38.1,36.83
N$387  (via drill 1.02 pad 1.88)
  other vias: 40.64,36.83
N$388  (via drill 1.02 pad 1.88)
  other vias: 43.18,36.83
N$389  (via drill 1.02 pad 1.88)
  other vias: 45.72,36.83
N$390  (via drill 1.02 pad 1.88)
  other vias: 48.26,36.83
N$391  (via drill 1.02 pad 1.88)
  other vias: 50.8,36.83
N$392  (via drill 1.02 pad 1.88)
  other vias: 53.34,36.83
N$393  (via drill 1.02 pad 1.88)
  other vias: 55.88,36.83
N$394  (via drill 1.02 pad 1.88)
  other vias: 58.42,36.83
N$395  (via drill 1.02 pad 1.88)
  other vias: 66.04,31.75
N$396  (via drill 1.02 pad 1.88)
  other vias: 63.5,31.75
N$397  (via drill 1.02 pad 1.88)
  other vias: 60.96,31.75
N$400  (via drill 1.02 pad 1.88)
  other vias: 30.48,34.29
N$401  (via drill 1.02 pad 1.88)
  other vias: 33.02,34.29
N$402  (via drill 1.02 pad 1.88)
  other vias: 35.56,34.29
N$403  (via drill 1.02 pad 1.88)
  other vias: 38.1,34.29
N$404  (via drill 1.02 pad 1.88)
  other vias: 40.64,34.29
N$405  (via drill 1.02 pad 1.88)
  other vias: 43.18,34.29
N$406  (via drill 1.02 pad 1.88)
  other vias: 45.72,34.29
N$407  (via drill 1.02 pad 1.88)
  other vias: 48.26,34.29
N$408  (via drill 1.02 pad 1.88)
  other vias: 50.8,34.29
N$409  (via drill 1.02 pad 1.88)
  other vias: 53.34,34.29
N$410  (via drill 1.02 pad 1.88)
  other vias: 55.88,34.29
N$411  (via drill 1.02 pad 1.88)
  other vias: 58.42,34.29
N$412  (via drill 1.02 pad 1.88)
  other vias: 66.04,34.29
N$413  (via drill 1.02 pad 1.88)
  other vias: 63.5,34.29
N$414  (via drill 1.02 pad 1.88)
  other vias: 60.96,34.29
N$417  (via drill 1.02 pad 1.88)
  other vias: 30.48,31.75
N$418  (via drill 1.02 pad 1.88)
  other vias: 33.02,31.75
N$419  (via drill 1.02 pad 1.88)
  other vias: 35.56,31.75
N$420  (via drill 1.02 pad 1.88)
  other vias: 38.1,31.75
N$421  (via drill 1.02 pad 1.88)
  other vias: 40.64,31.75
N$422  (via drill 1.02 pad 1.88)
  other vias: 43.18,31.75
N$423  (via drill 1.02 pad 1.88)
  other vias: 45.72,31.75
N$424  (via drill 1.02 pad 1.88)
  other vias: 48.26,31.75
N$425  (via drill 1.02 pad 1.88)
  other vias: 50.8,31.75
N$426  (via drill 1.02 pad 1.88)
  other vias: 53.34,31.75
N$427  (via drill 1.02 pad 1.88)
  other vias: 55.88,31.75
N$428  (via drill 1.02 pad 1.88)
  other vias: 58.42,31.75
N$429  (via drill 1.02 pad 1.88)
  other vias: 66.04,36.83
N$430  (via drill 1.02 pad 1.88)
  other vias: 63.5,36.83
N$431  (via drill 1.02 pad 1.88)
  other vias: 60.96,36.83
N$432  (via drill 1.02 pad 1.88)
  other vias: 68.58,36.83
N$433  (via drill 1.02 pad 1.88)
  other vias: 71.12,36.83
N$435  (via drill 1.02 pad 1.88)
  other vias: 68.58,34.29
N$436  (via drill 1.02 pad 1.88)
  other vias: 71.12,34.29
N$438  (via drill 1.02 pad 1.88)
  other vias: 68.58,31.75
N$439  (via drill 1.02 pad 1.88)
  other vias: 71.12,31.75
N$443  (via drill 1.02 pad 1.88)
  other vias: 30.48,29.21
N$444  (via drill 1.02 pad 1.88)
  other vias: 33.02,29.21
N$445  (via drill 1.02 pad 1.88)
  other vias: 35.56,29.21
N$446  (via drill 1.02 pad 1.88)
  other vias: 38.1,29.21
N$447  (via drill 1.02 pad 1.88)
  other vias: 40.64,29.21
N$448  (via drill 1.02 pad 1.88)
  other vias: 43.18,29.21
N$449  (via drill 1.02 pad 1.88)
  other vias: 45.72,29.21
N$450  (via drill 1.02 pad 1.88)
  other vias: 48.26,29.21
N$451  (via drill 1.02 pad 1.88)
  other vias: 50.8,29.21
N$452  (via drill 1.02 pad 1.88)
  other vias: 53.34,29.21
N$453  (via drill 1.02 pad 1.88)
  other vias: 55.88,29.21
N$454  (via drill 1.02 pad 1.88)
  other vias: 58.42,29.21
N$455  (via drill 1.02 pad 1.88)
  other vias: 66.04,24.13
N$456  (via drill 1.02 pad 1.88)
  other vias: 63.5,24.13
N$457  (via drill 1.02 pad 1.88)
  other vias: 60.96,24.13
N$460  (via drill 1.02 pad 1.88)
  other vias: 30.48,26.67
N$461  (via drill 1.02 pad 1.88)
  other vias: 33.02,26.67
N$462  (via drill 1.02 pad 1.88)
  other vias: 35.56,26.67
N$463  (via drill 1.02 pad 1.88)
  other vias: 38.1,26.67
N$464  (via drill 1.02 pad 1.88)
  other vias: 40.64,26.67
N$465  (via drill 1.02 pad 1.88)
  other vias: 43.18,26.67
N$466  (via drill 1.02 pad 1.88)
  other vias: 45.72,26.67
N$467  (via drill 1.02 pad 1.88)
  other vias: 48.26,26.67
N$468  (via drill 1.02 pad 1.88)
  other vias: 50.8,26.67
N$469  (via drill 1.02 pad 1.88)
  other vias: 53.34,26.67
N$470  (via drill 1.02 pad 1.88)
  other vias: 55.88,26.67
N$471  (via drill 1.02 pad 1.88)
  other vias: 58.42,26.67
N$472  (via drill 1.02 pad 1.88)
  other vias: 66.04,26.67
N$473  (via drill 1.02 pad 1.88)
  other vias: 63.5,26.67
N$474  (via drill 1.02 pad 1.88)
  other vias: 60.96,26.67
N$477  (via drill 1.02 pad 1.88)
  other vias: 30.48,24.13
N$478  (via drill 1.02 pad 1.88)
  other vias: 33.02,24.13
N$479  (via drill 1.02 pad 1.88)
  other vias: 35.56,24.13
N$480  (via drill 1.02 pad 1.88)
  other vias: 38.1,24.13
N$481  (via drill 1.02 pad 1.88)
  other vias: 40.64,24.13
N$482  (via drill 1.02 pad 1.88)
  other vias: 43.18,24.13
N$483  (via drill 1.02 pad 1.88)
  other vias: 45.72,24.13
N$484  (via drill 1.02 pad 1.88)
  other vias: 48.26,24.13
N$485  (via drill 1.02 pad 1.88)
  other vias: 50.8,24.13
N$486  (via drill 1.02 pad 1.88)
  other vias: 53.34,24.13
N$487  (via drill 1.02 pad 1.88)
  other vias: 55.88,24.13
N$488  (via drill 1.02 pad 1.88)
  other vias: 58.42,24.13
N$489  (via drill 1.02 pad 1.88)
  other vias: 66.04,29.21
N$490  (via drill 1.02 pad 1.88)
  other vias: 63.5,29.21
N$491  (via drill 1.02 pad 1.88)
  other vias: 60.96,29.21
N$492  (via drill 1.02 pad 1.88)
  other vias: 68.58,29.21
N$493  (via drill 1.02 pad 1.88)
  other vias: 71.12,29.21
N$495  (via drill 1.02 pad 1.88)
  other vias: 68.58,26.67
N$496  (via drill 1.02 pad 1.88)
  other vias: 71.12,26.67
N$498  (via drill 1.02 pad 1.88)
  other vias: 68.58,24.13
N$499  (via drill 1.02 pad 1.88)
  other vias: 71.12,24.13
N$503  (via drill 1.02 pad 1.88)
  other vias: 30.48,21.59
N$504  (via drill 1.02 pad 1.88)
  other vias: 33.02,21.59
N$505  (via drill 1.02 pad 1.88)
  other vias: 35.56,21.59
N$506  (via drill 1.02 pad 1.88)
  other vias: 38.1,21.59
N$507  (via drill 1.02 pad 1.88)
  other vias: 40.64,21.59
N$508  (via drill 1.02 pad 1.88)
  other vias: 43.18,21.59
N$509  (via drill 1.02 pad 1.88)
  other vias: 45.72,21.59
N$510  (via drill 1.02 pad 1.88)
  other vias: 48.26,21.59
N$511  (via drill 1.02 pad 1.88)
  other vias: 50.8,21.59
N$512  (via drill 1.02 pad 1.88)
  other vias: 53.34,21.59
N$513  (via drill 1.02 pad 1.88)
  other vias: 55.88,21.59
N$514  (via drill 1.02 pad 1.88)
  other vias: 58.42,21.59
N$515  (via drill 1.02 pad 1.88)
  other vias: 66.04,16.51
N$516  (via drill 1.02 pad 1.88)
  other vias: 63.5,16.51
N$517  (via drill 1.02 pad 1.88)
  other vias: 60.96,16.51
N$520  (via drill 1.02 pad 1.88)
  other vias: 30.48,19.05
N$521  (via drill 1.02 pad 1.88)
  other vias: 33.02,19.05
N$522  (via drill 1.02 pad 1.88)
  other vias: 35.56,19.05
N$523  (via drill 1.02 pad 1.88)
  other vias: 38.1,19.05
N$524  (via drill 1.02 pad 1.88)
  other vias: 40.64,19.05
N$525  (via drill 1.02 pad 1.88)
  other vias: 43.18,19.05
N$526  (via drill 1.02 pad 1.88)
  other vias: 45.72,19.05
N$527  (via drill 1.02 pad 1.88)
  other vias: 48.26,19.05
N$528  (via drill 1.02 pad 1.88)
  other vias: 50.8,19.05
N$529  (via drill 1.02 pad 1.88)
  other vias: 53.34,19.05
N$530  (via drill 1.02 pad 1.88)
  other vias: 55.88,19.05
N$531  (via drill 1.02 pad 1.88)
  other vias: 58.42,19.05
N$532  (via drill 1.02 pad 1.88)
  other vias: 66.04,19.05
N$533  (via drill 1.02 pad 1.88)
  other vias: 63.5,19.05
N$534  (via drill 1.02 pad 1.88)
  other vias: 60.96,19.05
N$537  (via drill 1.02 pad 1.88)
  other vias: 30.48,16.51
N$538  (via drill 1.02 pad 1.88)
  other vias: 33.02,16.51
N$539  (via drill 1.02 pad 1.88)
  other vias: 35.56,16.51
N$540  (via drill 1.02 pad 1.88)
  other vias: 38.1,16.51
N$541  (via drill 1.02 pad 1.88)
  other vias: 40.64,16.51
N$542  (via drill 1.02 pad 1.88)
  other vias: 43.18,16.51
N$543  (via drill 1.02 pad 1.88)
  other vias: 45.72,16.51
N$544  (via drill 1.02 pad 1.88)
  other vias: 48.26,16.51
N$545  (via drill 1.02 pad 1.88)
  other vias: 50.8,16.51
N$546  (via drill 1.02 pad 1.88)
  other vias: 53.34,16.51
N$547  (via drill 1.02 pad 1.88)
  other vias: 55.88,16.51
N$548  (via drill 1.02 pad 1.88)
  other vias: 58.42,16.51
N$549  (via drill 1.02 pad 1.88)
  other vias: 66.04,21.59
N$550  (via drill 1.02 pad 1.88)
  other vias: 63.5,21.59
N$551  (via drill 1.02 pad 1.88)
  other vias: 60.96,21.59
N$552  (via drill 1.02 pad 1.88)
  other vias: 68.58,21.59
N$553  (via drill 1.02 pad 1.88)
  other vias: 71.12,21.59
N$555  (via drill 1.02 pad 1.88)
  other vias: 68.58,19.05
N$556  (via drill 1.02 pad 1.88)
  other vias: 71.12,19.05
N$558  (via drill 1.02 pad 1.88)
  other vias: 68.58,16.51
N$559  (via drill 1.02 pad 1.88)
  other vias: 71.12,16.51
N$777  (via drill 1.02 pad 1.88)
  other vias: 66.04,13.97
N$778  (via drill 1.02 pad 1.88)
  other vias: 63.5,13.97
N$779  (via drill 1.02 pad 1.88)
  other vias: 60.96,13.97
N$782  (via drill 1.02 pad 1.88)
  other vias: 30.48,13.97
N$783  (via drill 1.02 pad 1.88)
  other vias: 33.02,13.97
N$784  (via drill 1.02 pad 1.88)
  other vias: 35.56,13.97
N$785  (via drill 1.02 pad 1.88)
  other vias: 38.1,13.97
N$786  (via drill 1.02 pad 1.88)
  other vias: 40.64,13.97
N$787  (via drill 1.02 pad 1.88)
  other vias: 43.18,13.97
N$788  (via drill 1.02 pad 1.88)
  other vias: 45.72,13.97
N$789  (via drill 1.02 pad 1.88)
  other vias: 48.26,13.97
N$790  (via drill 1.02 pad 1.88)
  other vias: 50.8,13.97
N$791  (via drill 1.02 pad 1.88)
  other vias: 53.34,13.97
N$792  (via drill 1.02 pad 1.88)
  other vias: 55.88,13.97
N$793  (via drill 1.02 pad 1.88)
  other vias: 58.42,13.97
N$794  (via drill 1.02 pad 1.88)
  other vias: 68.58,13.97
N$795  (via drill 1.02 pad 1.88)
  other vias: 71.12,13.97
N$799  (via drill 1.02 pad 1.88)
  other vias: 30.48,11.43
N$800  (via drill 1.02 pad 1.88)
  other vias: 33.02,11.43
N$801  (via drill 1.02 pad 1.88)
  other vias: 35.56,11.43
N$802  (via drill 1.02 pad 1.88)
  other vias: 38.1,11.43
N$803  (via drill 1.02 pad 1.88)
  other vias: 40.64,11.43
N$804  (via drill 1.02 pad 1.88)
  other vias: 43.18,11.43
N$805  (via drill 1.02 pad 1.88)
  other vias: 45.72,11.43
N$806  (via drill 1.02 pad 1.88)
  other vias: 48.26,11.43
N$807  (via drill 1.02 pad 1.88)
  other vias: 50.8,11.43
N$808  (via drill 1.02 pad 1.88)
  other vias: 53.34,11.43
N$809  (via drill 1.02 pad 1.88)
  other vias: 55.88,11.43
N$810  (via drill 1.02 pad 1.88)
  other vias: 58.42,11.43
N$811  (via drill 1.02 pad 1.88)
  other vias: 66.04,6.35
N$812  (via drill 1.02 pad 1.88)
  other vias: 63.5,6.35
N$813  (via drill 1.02 pad 1.88)
  other vias: 60.96,6.35
N$816  (via drill 1.02 pad 1.88)
  other vias: 30.48,8.89
N$817  (via drill 1.02 pad 1.88)
  other vias: 33.02,8.89
N$818  (via drill 1.02 pad 1.88)
  other vias: 35.56,8.89
N$819  (via drill 1.02 pad 1.88)
  other vias: 38.1,8.89
N$820  (via drill 1.02 pad 1.88)
  other vias: 40.64,8.89
N$821  (via drill 1.02 pad 1.88)
  other vias: 43.18,8.89
N$822  (via drill 1.02 pad 1.88)
  other vias: 45.72,8.89
N$823  (via drill 1.02 pad 1.88)
  other vias: 48.26,8.89
N$824  (via drill 1.02 pad 1.88)
  other vias: 50.8,8.89
N$825  (via drill 1.02 pad 1.88)
  other vias: 53.34,8.89
N$826  (via drill 1.02 pad 1.88)
  other vias: 55.88,8.89
N$827  (via drill 1.02 pad 1.88)
  other vias: 58.42,8.89
N$828  (via drill 1.02 pad 1.88)
  other vias: 66.04,8.89
N$829  (via drill 1.02 pad 1.88)
  other vias: 63.5,8.89
N$830  (via drill 1.02 pad 1.88)
  other vias: 60.96,8.89
N$833  (via drill 1.02 pad 1.88)
  other vias: 30.48,6.35
N$834  (via drill 1.02 pad 1.88)
  other vias: 33.02,6.35
N$835  (via drill 1.02 pad 1.88)
  other vias: 35.56,6.35
N$836  (via drill 1.02 pad 1.88)
  other vias: 38.1,6.35
N$837  (via drill 1.02 pad 1.88)
  other vias: 40.64,6.35
N$838  (via drill 1.02 pad 1.88)
  other vias: 43.18,6.35
N$839  (via drill 1.02 pad 1.88)
  other vias: 45.72,6.35
N$840  (via drill 1.02 pad 1.88)
  other vias: 48.26,6.35
N$841  (via drill 1.02 pad 1.88)
  other vias: 50.8,6.35
N$842  (via drill 1.02 pad 1.88)
  other vias: 53.34,6.35
N$843  (via drill 1.02 pad 1.88)
  other vias: 55.88,6.35
N$844  (via drill 1.02 pad 1.88)
  other vias: 58.42,6.35
N$845  (via drill 1.02 pad 1.88)
  other vias: 66.04,11.43
N$846  (via drill 1.02 pad 1.88)
  other vias: 63.5,11.43
N$847  (via drill 1.02 pad 1.88)
  other vias: 60.96,11.43
N$848  (via drill 1.02 pad 1.88)
  other vias: 68.58,11.43
N$849  (via drill 1.02 pad 1.88)
  other vias: 71.12,11.43
N$851  (via drill 1.02 pad 1.88)
  other vias: 68.58,8.89
N$852  (via drill 1.02 pad 1.88)
  other vias: 71.12,8.89
N$854  (via drill 1.02 pad 1.88)
  other vias: 68.58,6.35
N$855  (via drill 1.02 pad 1.88)
  other vias: 71.12,6.35

### Text on the board
Bottom: v14
tPlace: GND | 5V | GND | 5V | MyDAQ | Prototyping | Board | 5V | DGND | 7 | 6 | 5 | DIO | 4 | 3 | 2 | 1 | 0 | 1- | 1+ | AI | 0- | 0+ | AGND | 1 | AO | 0 | AGND | -15V | +15V | GND | 5V | GND | 5V
tNames: H. Hoops
tValues: T. Klopfenstein